# Altium schematic sheet ICSL_PS_PCC_ATDE.SchDoc
size A
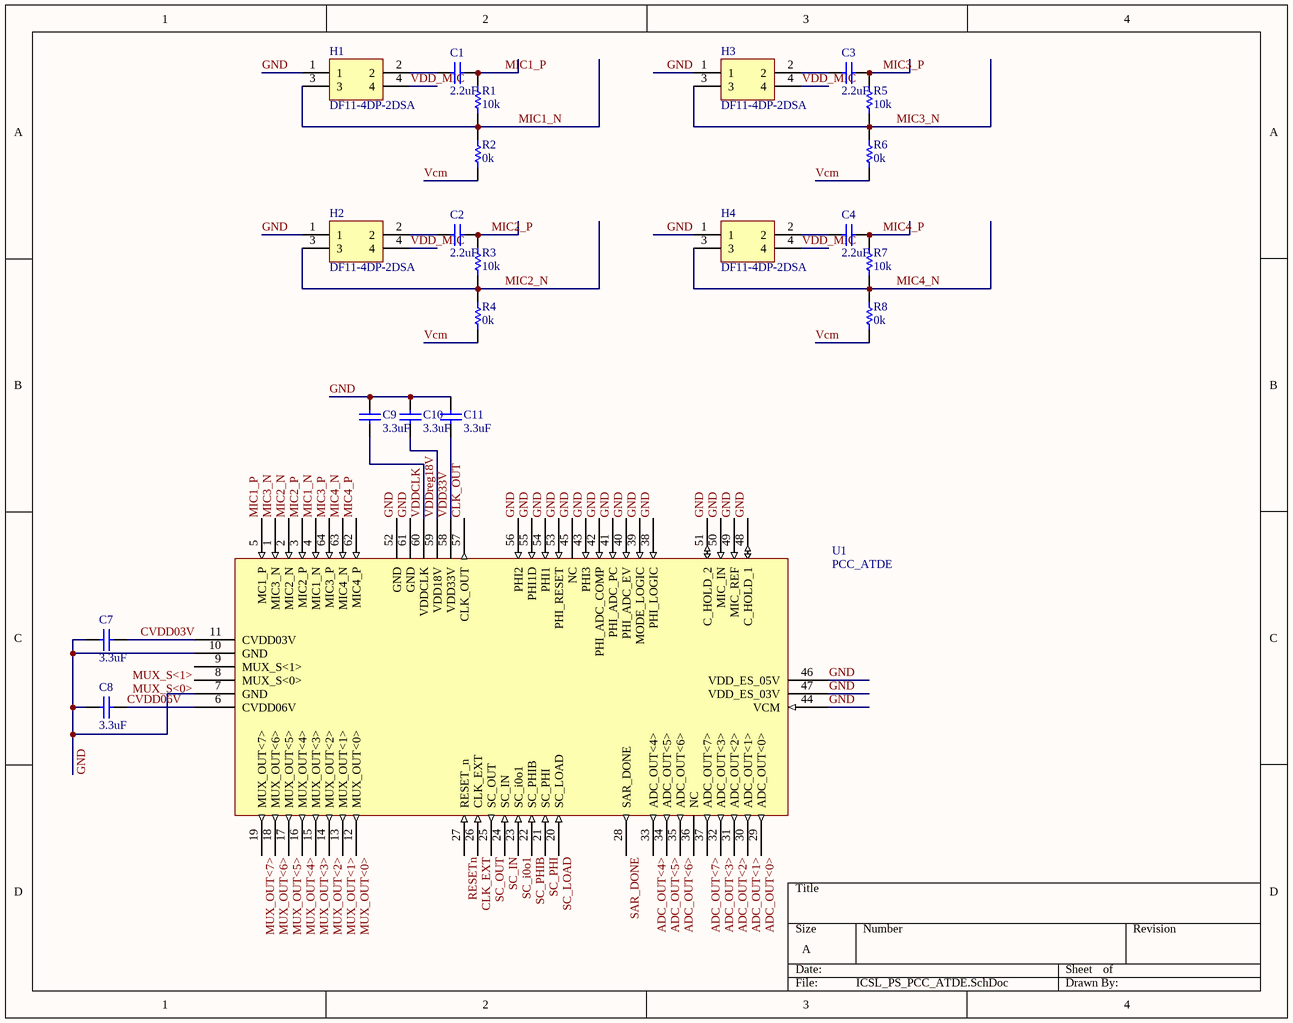
[diagram p0: ICSL_PS_PCC_ATDE.SchDoc]

## Parts
C1  2.2uF  [CAPC1608X90X35NL15T15]
C2  2.2uF  [CAPC1608X90X35NL15T15]
C3  2.2uF  [CAPC1608X90X35NL15T15]
C4  2.2uF  [CAPC1608X90X35NL15T15]
C7  3.3uF  [CAPC1608X90X35NL15T15]
C8  3.3uF  [CAPC1608X90X35NL15T15]
C9  3.3uF  [CAPC1608X90X35NL15T15]
C10  3.3uF  [CAPC1608X90X35NL15T15]
C11  3.3uF  [CAPC1608X90X35NL15T15]
H1  DF11-4DP-2DSA  [PCB-xg1cw1zwm1fua28k7qwq-1]
H2  DF11-4DP-2DSA  [PCB-xg1cw1zwm1fua28k7qwq-1]
H3  DF11-4DP-2DSA  [PCB-xg1cw1zwm1fua28k7qwq-1]
H4  DF11-4DP-2DSA  [PCB-xg1cw1zwm1fua28k7qwq-1]
R1  10k  [RESC1609X50X30NL10T20]
R2  0k  [RESC1609X50X30NL10T20]
R3  10k  [RESC1609X50X30NL10T20]
R4  0k  [RESC1609X50X30NL10T20]
R5  10k  [RESC1609X50X30NL10T20]
R6  0k  [RESC1609X50X30NL10T20]
R7  10k  [RESC1609X50X30NL10T20]
R8  0k  [RESC1609X50X30NL10T20]
U1  PCC_ATDE  [Quad64]

## Nets
ADC_OUT<0>: U1.29(ADC_OUT<0>)
ADC_OUT<1>: U1.30(ADC_OUT<1>)
ADC_OUT<2>: U1.31(ADC_OUT<2>)
ADC_OUT<3>: U1.32(ADC_OUT<3>)
ADC_OUT<4>: U1.33(ADC_OUT<4>)
ADC_OUT<5>: U1.34(ADC_OUT<5>)
ADC_OUT<6>: U1.35(ADC_OUT<6>)
ADC_OUT<7>: U1.37(ADC_OUT<7>)
CLK_EXT: U1.26(CLK_EXT)
CLK_OUT: U1.57(CLK_OUT)
CVDD03V: C7.1 U1.11(CVDD03V)
CVDD06V: C8.1 U1.6(CVDD06V)
GND: C7.2 C8.2 C9.2 C10.1 C11.1 H1.1 H2.1 H3.1 H4.1 U1.7(GND) U1.10(GND) U1.38(PHI_LOGIC) U1.39(MODE_LOGIC) U1.40(PHI_ADC_EV) U1.41(PHI_ADC_PC) U1.42(PHI_ADC_COMP) U1.43(PHI3) U1.44(VCM) U1.45(NC) U1.46(VDD_ES_05V) U1.47(VDD_ES_03V) U1.48(C_HOLD_1) U1.49(MIC_REF) U1.50(MIC_IN) U1.51(C_HOLD_2) U1.52(GND) U1.53(PHI_RESET) U1.54(PHI1) U1.55(PHI1D) U1.56(PHI2) U1.61(GND)
MIC1_N: H1.3 R1.2 R2.2 U1.4(MIC1_N)
MIC1_P: C1.2 R1.1 U1.5(MC1_P)
MIC2_N: H2.3 R3.2 R4.2 U1.2(MIC2_N)
MIC2_P: C2.2 R3.1 U1.3(MIC2_P)
MIC3_N: H3.3 R5.2 R6.2 U1.1(MIC3_N)
MIC3_P: C3.2 R5.1 U1.64(MIC3_P)
MIC4_N: H4.3 R7.2 R8.2 U1.63(MIC4_N)
MIC4_P: C4.2 R7.1 U1.62(MIC4_P)
MUX_OUT<0>: U1.12(MUX_OUT<0>)
MUX_OUT<1>: U1.13(MUX_OUT<1>)
MUX_OUT<2>: U1.14(MUX_OUT<2>)
MUX_OUT<3>: U1.15(MUX_OUT<3>)
MUX_OUT<4>: U1.16(MUX_OUT<4>)
MUX_OUT<5>: U1.17(MUX_OUT<5>)
MUX_OUT<6>: U1.18(MUX_OUT<6>)
MUX_OUT<7>: U1.19(MUX_OUT<7>)
MUX_S<0>: U1.8(MUX_S<0>)
MUX_S<1>: U1.9(MUX_S<1>)
RESETn: U1.27(RESET_n)
SAR_DONE: U1.28(SAR_DONE)
SC_i0o1: U1.23(SC_i0o1)
SC_IN: U1.24(SC_IN)
SC_LOAD: U1.20(SC_LOAD)
SC_OUT: U1.25(SC_OUT)
SC_PHI: U1.21(SC_PHI)
SC_PHIB: U1.22(SC_PHIB)
Vcm: R2.1 R4.1 R6.1 R8.1
VDD33V: C11.2 U1.58(VDD33V)
VDD_MIC: H1.4 H2.4 H3.4 H4.4
VDDCLK: C9.1 U1.60(VDDCLK)
VDDreg18V: C10.2 U1.59(VDD18V)
NetC1_1: C1.1 H1.2
NetC2_1: C2.1 H2.2
NetC3_1: C3.1 H3.2
NetC4_1: C4.1 H4.2

Not connected (* = marked no-connect by the designer): U1 36(NC)

## Library data of the parts
C1-C4 C7-C11 = CMP-4105021-1: Multilayer Ceramic Capacitors MLCC - SMD/SMT 0603 10uF 4VOLTS X5R 10%; Manufacturer Part Number: 06034D106KAT2A; Temperature Coefficient / Code: +/- 15 %; Case Width: 0.81 mm; Voltage Rating DC: 4 V; Brand: AVX; Case Length: 1.6 mm; Type: Commercial Surface Mount Chip; Case Height: 0.9 mm; Dimensions: 0.81 mm W x 1.6 mm L x 0.9 mm H; Capacitance: 10 uF; Termination Style: SMD/SMT; Dielectric: X5R; RoHS: Details; Factory Pack Quantity: 3000; Ciiva URL: https://ciiva.com/part/06034d106kat2a-4105021; Operating Temperature Range: - 55 C to + 85 C; Case Code - mm: 1608; Case Code - in: 0603; Tolerance: 10 %; Voltage Rating: 4 V; Manufacturer: AVX; Minimum Operating Temperature: - 55 C; Product Category: Multilayer Ceramic Capacitors MLCC - SMD/SMT; Maximum Operating Temperature: + 85 C; Package / Case: 0603 (1608 metric); Product: General Type MLCCs; Packaging: Reel; CiivaID: 4105021
H1-H4 = DF11-4DP-2DSA(01): 4 Position 2mm Pitch Dual Row (2x2) Straight Through Hole Pin Header; Housing Color: Black; Contact Material: Brass
R1 R3 = CMP-1856112-2: RES SMD OHM 5% 1/10W 0603; Lead-Free Status: Lead Free; Power Rating: 0.1 W; Resistance: 200K; Temperature Coefficient: 200.0 ppm/°C; Voltage Rating (DC): 75.0 V; Case/Package: 0603; Mounting Style: Surface Mount; Number of Pins: 2; Octopart Url: https://octopart.com/crcw06032m20jnea-vishay-46591516; OctopartID: 4b2a80e6805094ed; Packaging: Cut Tape (CT); Resistance Tolerance: ±5%; RoHS: Compliant; Size-Height: 0.00045 m; Size-Length: 0.00155 m; Size-Width: 0.00085 m
R2 R4 R8 = CMP-1856112-2: RES SMD 2.2M OHM 5% 1/10W 0603; Lead-Free Status: Lead Free; Power Rating: 0.1 W; Resistance: 0; Temperature Coefficient: 200.0 ppm/°C; Voltage Rating (DC): 75.0 V; Case/Package: 0603; Mounting Style: Surface Mount; Number of Pins: 2; Octopart Url: https://octopart.com/crcw06032m20jnea-vishay-46591516; OctopartID: 4b2a80e6805094ed; Packaging: Cut Tape (CT); Resistance Tolerance: ±5%; RoHS: Compliant; Size-Height: 0.00045 m; Size-Length: 0.00155 m; Size-Width: 0.00085 m
R5 = CMP-1856112-2: RES SMD 2.2M OHM 5% 1/10W 0603; Lead-Free Status: Lead Free; Power Rating: 0.1 W; Resistance: 200K; Temperature Coefficient: 200.0 ppm/°C; Voltage Rating (DC): 75.0 V; Case/Package: 0603; Mounting Style: Surface Mount; Number of Pins: 2; Octopart Url: https://octopart.com/crcw06032m20jnea-vishay-46591516; OctopartID: 4b2a80e6805094ed; Packaging: Cut Tape (CT); Resistance Tolerance: ±5%; RoHS: Compliant; Size-Height: 0.00045 m; Size-Length: 0.00155 m; Size-Width: 0.00085 m
R6 = CMP-1856112-2: RES SMD 2.2M OHM 5% 1/10W 0603; Lead-Free Status: Lead Free; Power Rating: 0.1 W; Resistance: 2200000.0 Ω; Temperature Coefficient: 200.0 ppm/°C; Voltage Rating (DC): 75.0 V; Case/Package: 0603; Mounting Style: Surface Mount; Number of Pins: 2; Octopart Url: https://octopart.com/crcw06032m20jnea-vishay-46591516; OctopartID: 4b2a80e6805094ed; Packaging: Cut Tape (CT); Resistance Tolerance: ±5%; RoHS: Compliant; Size-Height: 0.00045 m; Size-Length: 0.00155 m; Size-Width: 0.00085 m
R7 = CMP-1856112-2: RES SMD  OHM 5% 1/10W 0603; Lead-Free Status: Lead Free; Power Rating: 0.1 W; Resistance: 2200000.0 Ω; Resistance Tolerance: 200K; Temperature Coefficient: 200.0 ppm/°C; Voltage Rating (DC): 75.0 V; Case/Package: 0603; Mounting Style: Surface Mount; Number of Pins: 2; Octopart Url: https://octopart.com/crcw06032m20jnea-vishay-46591516; OctopartID: 4b2a80e6805094ed; Packaging: Cut Tape (CT); RoHS: Compliant; Size-Height: 0.00045 m; Size-Length: 0.00155 m; Size-Width: 0.00085 m
U1 = CMP-47mcin27x3h8n761pmad-3: ASP; CustomComponentID: 47mcin27x3h8n761pmad